# EAGLE design basicTwoPartSchematic (EAGLE 7.4.0)
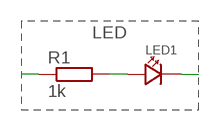
[diagram p0: schematic, sheet 1]

## Parts
LED1  LED5MM  [LED-5MM]
R1  1k  R-EU_R0805  [R0805]

## Nets
ANODE: R1.1
CATHODE: LED1.K(C)
INT-1: LED1.A R1.2

## Notes on the sheet
- LED

## Library data of the parts
LED1 = p.peter-leds:LED
R1 = p.peter-rcl:R-EU_: RESISTOR, European symbol

## Board
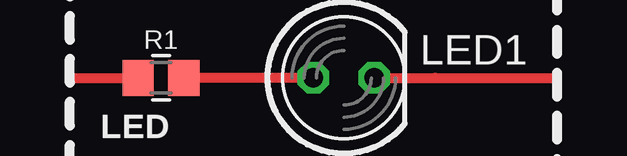
[diagram p1: board, top side]

No outline drawn. Coordinates in mm, seen from the top.
Copper layers (1*16): Top 0.035mm / dielectric 1.5mm / Bottom 0.035mm
Design rules "default": minimum track width 10mil, minimum drill 24mil, track to track 8mil, track to pad 8mil, pad to pad 8mil, via to via 8mil, smd to smd 8mil, copper to edge 40mil, drill to drill 8mil, minimum pad ring 10mil, minimum via ring 8mil, stop-mask expansion 4mil, vias tented up to drill 0mil, thermal gap 10mil

### Footprints (pad centres in the part's own frame; a part is rotated, then mirrored left to right if it is on the bottom)
LED-5MM = drill 0.813 octagon: A -1.27,0; K 1.27,0
R0805 = smd 1.3 x 1.5: 1 -0.95,0; 2 0.95,0

### Placement (x,y rotation side)
LED1  11.43,3.81 0 top
R1  3.81,3.81 0 top

### Tracks (layer width: path | path; a pad name or v marks a point on that pad's centre or on a via)
ANODE
  Top 0.406: 0,3.81 R1.1
CATHODE
  Top 0.406: LED1.K 15.24,3.81 20.32,3.81
INT-1
  Top 0.406: LED1.A R1.2

### Text on the board
tPlace: LED